# EAGLE design Adafruit TFT144 Breakout rev B (EAGLE 6.4)
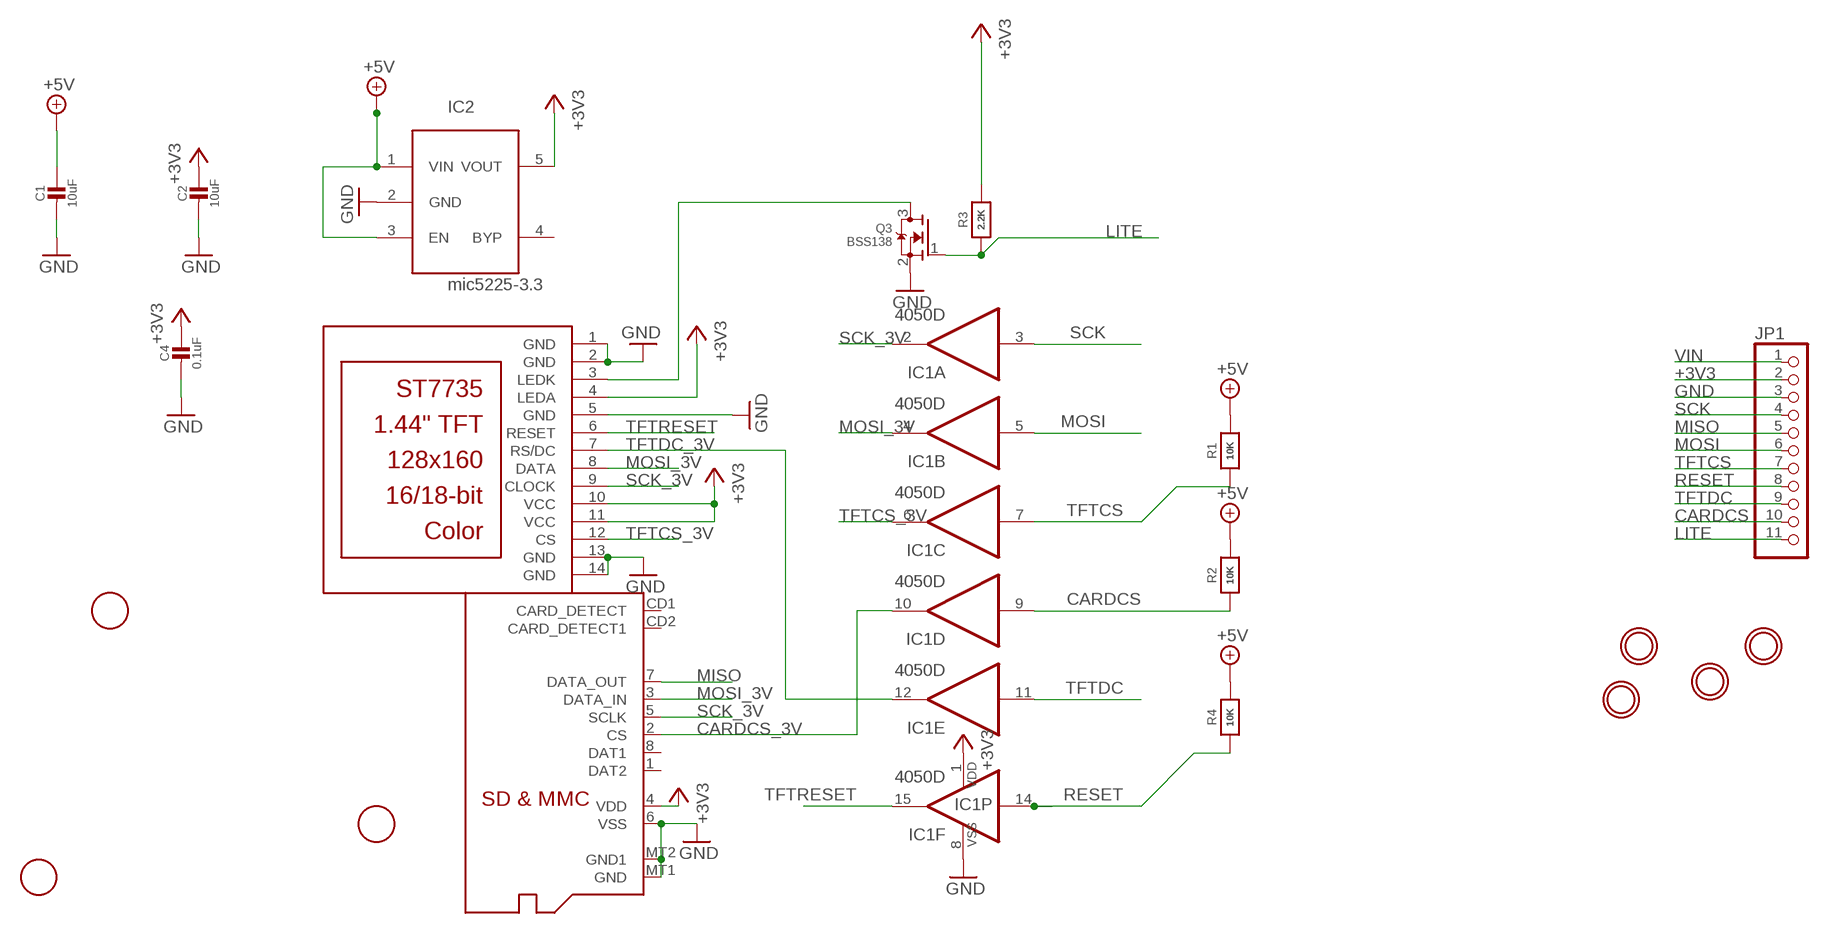
[diagram p0: schematic, sheet 1]

## Parts
C1  10uF  CAP_CERAMIC0805-NOOUTLINE  [0805-NO]
C2  10uF  CAP_CERAMIC0805-NOOUTLINE  [0805-NO]
C4  0.1uF  CAP_CERAMIC0805-NOOUTLINE  [0805-NO]
IC1  4050D  [SO16]
IC2  mic5225-3.3  LP298XS  [SOT23-5L]
JP1  HEADER-1X1176MIL  [1X11_ROUND_76]
Q2  MICROSD  [MICROSD]
Q3  BSS138  MOSFET-NWIDE  [SOT23-WIDE]
R1  10K  RESISTOR0805_NOOUTLINE  [0805-NO]
R2  10K  RESISTOR0805_NOOUTLINE  [0805-NO]
R3  2.2K  RESISTOR0805_NOOUTLINE  [0805-NO]
R4  10K  RESISTOR0805_NOOUTLINE  [0805-NO]
TFT2  DISP_LCD_ST7735_1.44IN  [TFT_1.44IN_128_128]
U$3  FIDUCIAL  [FIDUCIAL_1MM]
U$4  FIDUCIAL  [FIDUCIAL_1MM]
U$5  FIDUCIAL  [FIDUCIAL_1MM]
U$7  MOUNTINGHOLE2.5  [MOUNTINGHOLE_2.5_PLATED]
U$8  MOUNTINGHOLE2.5  [MOUNTINGHOLE_2.5_PLATED]
U$9  MOUNTINGHOLE2.5  [MOUNTINGHOLE_2.5_PLATED]
U$10  MOUNTINGHOLE2.5  [MOUNTINGHOLE_2.5_PLATED]

## Nets
+3V3 [power]: C2.1 C4.1 IC1.1(P:VDD) IC2.5(VOUT) JP1.2 Q2.4(VDD) R3.2 TFT2.4(LEDA) TFT2.10(VCC) TFT2.11(VCC)
CARDCS: IC1.9(D:I) JP1.10 R2.1
CARDCS_3V: IC1.10(D:O) Q2.2(CS)
GND: C1.2 C2.2 C4.2 IC1.8(P:VSS) IC2.2(GND) JP1.3 Q2.6(VSS) Q2.MT1(GND) Q2.MT2(GND1) Q3.2(S) TFT2.1(GND) TFT2.2(GND) TFT2.5(GND) TFT2.13(GND) TFT2.14(GND)
LITE: JP1.11 Q3.1(G) R3.1
MISO: JP1.5 Q2.7(DATA_OUT)
MOSI: IC1.5(B:I) JP1.6
MOSI_3V: IC1.4(B:O) Q2.3(DATA_IN) TFT2.8(DATA)
N$5: Q3.3(D) TFT2.3(LEDK)
RESET: IC1.14(F:I) JP1.8 R4.1
SCK: IC1.3(A:I) JP1.4
SCK_3V: IC1.2(A:O) Q2.5(SCLK) TFT2.9(CLOCK)
TFTCS: IC1.7(C:I) JP1.7 R1.1
TFTCS_3V: IC1.6(C:O) TFT2.12(CS)
TFTDC: IC1.11(E:I) JP1.9
TFTDC_3V: IC1.12(E:O) TFT2.7(RS/DC)
TFTRESET: IC1.15(F:O) TFT2.6(RESET)
VIN [power]: C1.1 IC2.1(VIN) IC2.3(EN) JP1.1 R1.2 R2.2 R4.2 ; supply symbol labelled +5V
Unconnected: IC2.4(BYP) Q2.1(DAT2) Q2.8(DAT1) Q2.CD1(CARD_DETECT) Q2.CD2(CARD_DETECT1)

## Library data of the parts
C1 C2 C4 = microbuilder:CAP_CERAMIC: Ceramic Capacitors For new designs, use the packages preceded by an '_' character since they are more reliable: The following footprints should be used on most boards: _0402 - Standard footprint for regular board layouts _0603 - Standard footprint for regular board layouts _0805 - Standard footprint for regular board layouts _1206 - Standard footprint for regular board layouts For extremely tight-pitch boards where space is at a premium, the following 'micro-pitch' footprints can be used (smaller pads, no silkscreen outline, etc.): _0402MP - Micro-pitch footprint for very dense/compact boards _0603MP - Micro-pitch footprint for very dense/compact boards _0805MP - Micro-pitch footprint for very dense/compact boards _1206MP - Micro-pitch footprint for very dense/compact boards
IC1 = 40xx:4050: Hex non-inverting BUFFER
IC2 = adafruit:LP298X
JP1 = microbuilder:HEADER-1X11
Q2 = adafruit:MICROSD: Micro-SD / Transflash card holder with SPI pinout For the 3M # 2908-05WB-MG and/or 4UCON #19656 push-push type
Q3 = microbuilder:MOSFET-N: N-Channel Mosfet LEGEND VDS: Voltage Drain-Source ID: Drain Current RDS(ON): Drain-Source On-State Resistance VGS(TH): Gate-Source Threshold Voltage CISS: Drain-Source Input Capacitance SOT-23 Name VDS ID RDS(ON) VGS(TH) CISS Order Number 2N7002E 60V 260mA 2.5 Ohm 2.5V @ 250uA 26.7pF @ 25V 2N7002ET1GOSTR-ND BSH103 30V 850mA 400 mOhm 400mV @ 1mA 83pF @ 24V BSH103,235-ND BSS138 60V 320mA 1.6 Ohm 1.5V @ 250uA 50pF @ 10V Mouser: 771-BSS138PW115 DMN2075U-7 20V 4.2A 38 mOhm 1V @ 250 uA 594.3pF @ 10V DMN2075U-7DICT-ND * BSS138 good choice for I2C level-shifting POWERPAK 1212-8 Name VDS ID RDS(ON) VGS(TH) CISS Order Number Si7308DN 60V 6A 58 mOhm 3V @ 250uA 665pF @ 15V SI7308DN-T1-E3CT-ND
R1-R4 = microbuilder:RESISTOR: Resistors For new designs, use the packages preceded by an '_' character since they are more reliable: The following footprints should be used on most boards: _0402 - Standard footprint for regular board layouts _0603 - Standard footprint for regular board layouts _0805 - Standard footprint for regular board layouts _1206 - Standard footprint for regular board layouts For extremely tight-pitch boards where space is at a premium, the following 'micro-pitch' footprints can be used (smaller pads, no silkscreen outline, etc.): _0402MP - Micro-pitch footprint for very dense/compact boards _0603MP - Micro-pitch footprint for very dense/compact boards _0805MP - Micro-pitch footprint for very dense/compact boards _1206MP - Micro-pitch footprint for very dense/compact boards
TFT2 = microbuilder:DISP_LCD_ST7735_1.44IN
U$3-U$5 = adafruit:FIDUCIAL: For use by pick and place machines to calibrate the vision/machine, 1mm By microbuilder.eu
U$7-U$10 = microbuilder:MOUNTINGHOLE: Mounting Hole For #2 screws (0.086"/2.18mm width, 0.094"/2.4mm hole) use 2.5mm; BOM: EXCLUDE

## Net classes
1 power: width 0.406 mm

## Board
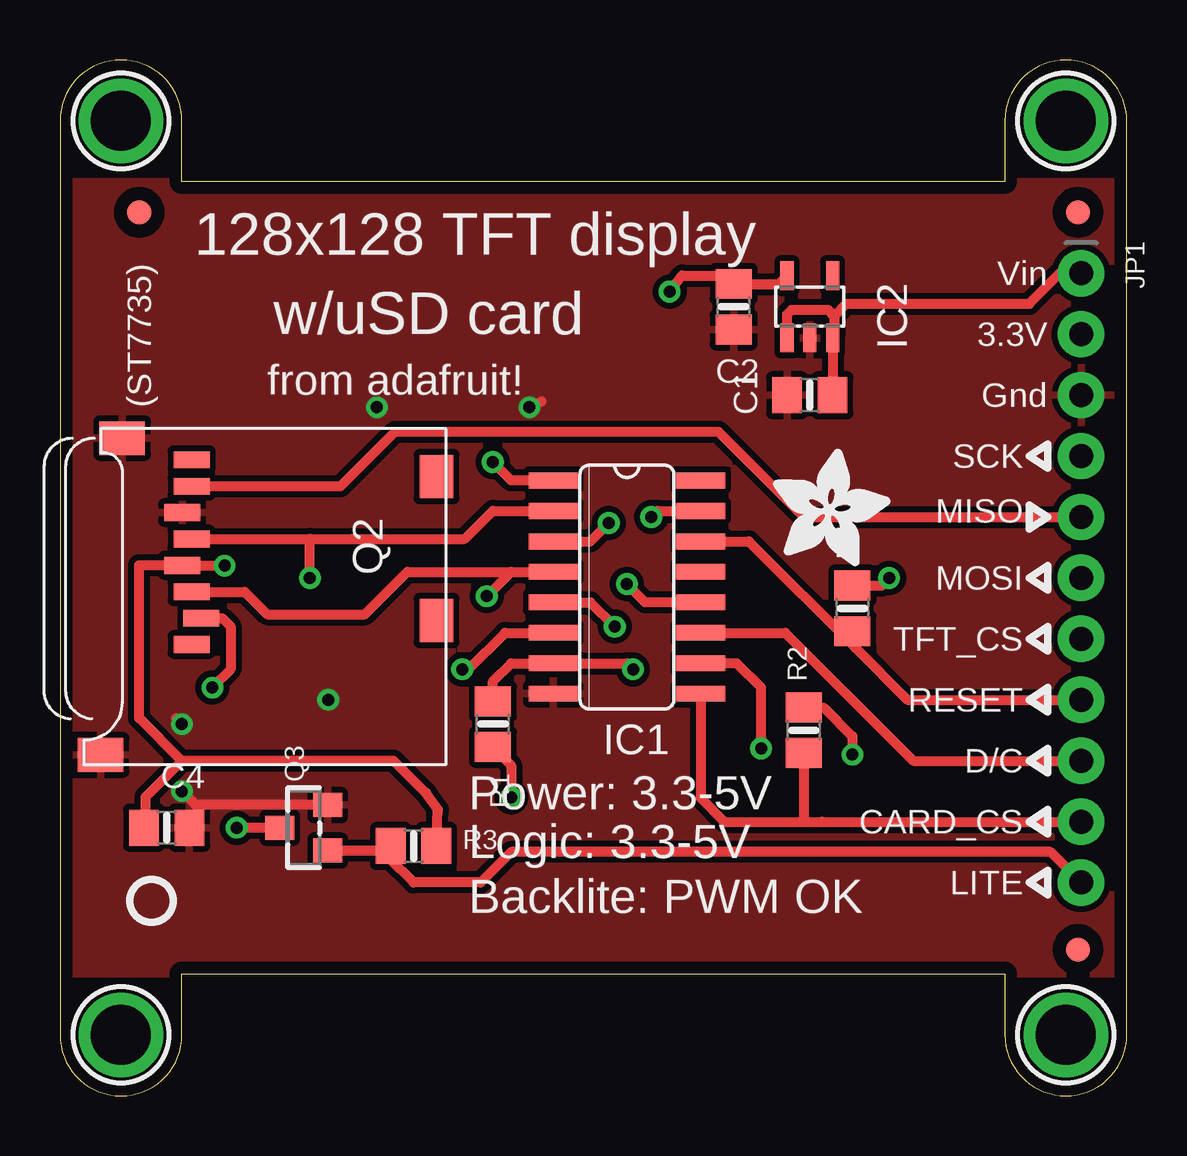
[diagram p1: board, top side]
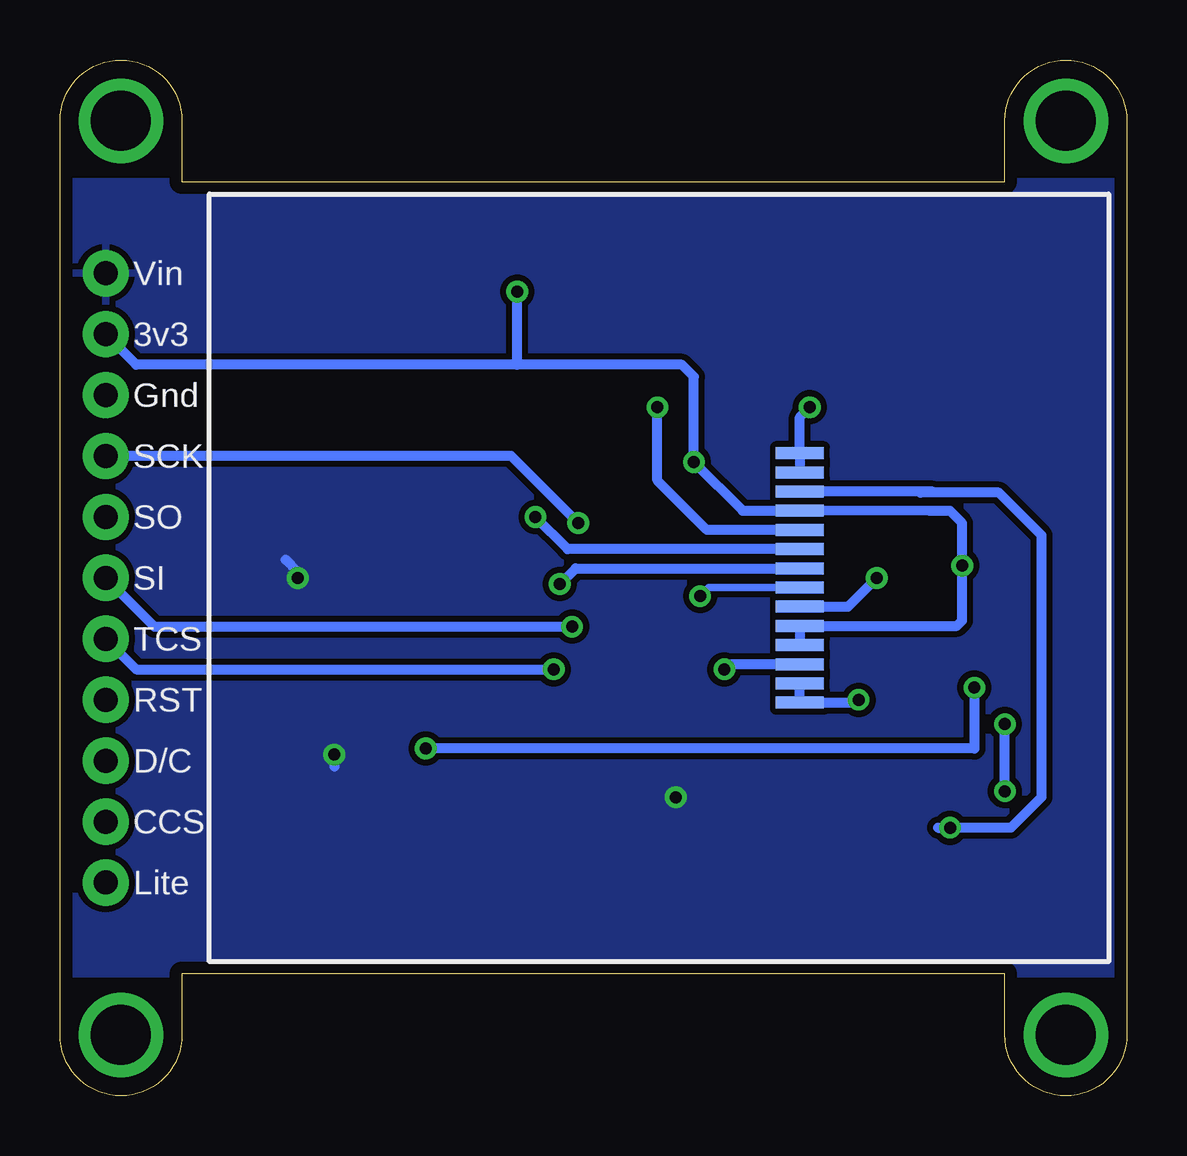
[diagram p2: board, bottom side, seen from below]

Size 44.45 x 43.18 mm. Coordinates in mm from the lower left corner, seen from the top.
Outline: 39.37,5.08 39.37,2.54 arc90 41.91,0 arc90 44.45,2.54 44.45,40.64 arc90 41.91,43.18 arc90 39.37,40.64 39.37,38.1 5.08,38.1 5.08,40.64 arc90 2.54,43.18 arc90 0,40.64 0,2.54 arc90 2.54,0 arc90 5.08,2.54 5.08,5.08 39.37,5.08
Copper layers (1*16): Top 0.035mm / dielectric 1.5mm / Bottom 0.035mm
Design rules "default *": minimum track width 10mil, minimum drill 14mil, track to track 10mil, track to pad 10mil, pad to pad 10mil, via to via 10mil, smd to smd 8mil, copper to edge 20mil, drill to drill 8mil, minimum pad ring 10mil, minimum via ring 8mil, stop-mask expansion 4mil, vias tented up to drill 20mil, thermal gap 10mil

### Footprints (pad centres in the part's own frame; a part is rotated, then mirrored left to right if it is on the bottom)
0805-NO = smd 1.24 x 1.5: 1 -0.95,0; 2 0.95,0
SO16 = smd 0.66 x 2.032: 1 -4.445,-3.073; 2 -3.175,-3.073; 3 -1.905,-3.073; 4 -0.635,-3.073; 5 0.635,-3.073; 6 1.905,-3.073; 7 3.175,-3.073; 8 4.445,-3.073; 9 4.445,3.073; 10 3.175,3.073; 11 1.905,3.073; 12 0.635,3.073; 13 -0.635,3.073; 14 -1.905,3.073; 15 -3.175,3.073; 16 -4.445,3.073
SOT23-5L = smd 0.55 x 1.2: 1 -0.95,-1.3; 2 0,-1.3; 3 0.95,-1.3; 4 0.95,1.3; 5 -0.95,1.3
1X11_ROUND_76 = drill 1 pad 1.93: 1 -12.7,0; 2 -10.16,0; 3 -7.62,0; 4 -5.08,0; 5 -2.54,0; 6 0,0; 7 2.54,0; 8 5.08,0; 9 7.62,0; 10 10.16,0; 11 12.7,0
MICROSD = smd 0.7 x 1.5: 1 9,-10.64; 2 7.9,-10.24; 3 6.8,-10.64; 4 5.7,-11.04; 5 4.6,-10.64; 6 3.5,-11.04; 7 2.4,-10.64; 8 1.3,-10.64 | smd 1.8 x 1.4: CD1 2,-0.44; CD2 8,-0.44 | smd 1.4 x 1.9: MT1 0.4,-13.54; MT2 13.6,-14.44
SOT23-WIDE = smd 1 x 1.2: 1 -0.95,-1; 2 0.95,-1; 3 0,1
TFT_1.44IN_128_128 = smd 0.5 x 2: 1 5.2,12.855; 2 4.4,12.855; 3 3.6,12.855; 4 2.8,12.855; 5 2,12.855; 6 1.2,12.855; 7 0.4,12.855; 8 -0.4,12.855; 9 -1.2,12.855; 10 -2,12.855; 11 -2.8,12.855; 12 -3.6,12.855; 13 -4.4,12.855; 14 -5.2,12.855
FIDUCIAL_1MM = smd 1 x 1: 1 0,0
MOUNTINGHOLE_2.5_PLATED = drill 2.5 pad 3.2: P$1 0,0

### Placement (x,y rotation side)
C1  31.24,29.21 180 top
C2  28.07,32.89 270 top
C4  4.45,11.18 0 top
IC1  23.62,21.21 270 top
IC2  31.24,32.89 0 top
JP1  42.55,21.59 270 top
Q2  16.13,27.81 270 top
Q3  10.16,11.18 90 top
R1  18.03,15.49 270 top
R2  30.99,15.24 90 top
R3  14.73,10.41 0 top
R4  33.02,20.32 90 top
TFT2  0.76,21.59 90 bottom
U$1  [ADAFRUIT_5MM]  29.72,22.1 0 top
U$2  [PCBFEAT-REV-040]  3.81,8.13 0 top
U$3  42.42,6.1 0 top
U$4  3.3,36.83 0 top
U$5  42.42,36.83 0 top
U$7  2.54,40.64 0 top
U$8  2.54,2.54 0 top
U$9  41.91,40.64 0 top
U$10  41.91,2.54 0 top

### Tracks (layer width: path | path; a pad name or v marks a point on that pad's centre or on a via)
+3V3  (via drill 0.5)
  Top 0.406: IC2.5 29.94,33.84 C2.1 27.72,34.19 25.91,34.19 v25.4,33.53 | v6.86,22.1 6.87,22.11 Q2.4 3.3,22.11 3.3,15.75 5.08,13.97 | IC1.1 18.8,25.65 v18.03,26.42 | R3.2 15.75,11.94 15.24,12.63 13.9,13.97 5.08,13.97 | 5.08,13.97 3.56,12.45 3.56,11.24 C4.1
  Bottom 0.406: TFT2.11 TFT2.10 7.08,19.59 6.86,19.81 v6.86,22.1 6.86,23.88 7.37,24.38 8.23,24.38 TFT2.4 16.01,24.39 v18.03,26.42 18.03,29.97 18.54,30.48 25.4,30.48 | 25.4,30.48 v25.4,33.53 | 25.4,30.48 41.27,30.48 JP1.2
CARDCS
  Top 0.406: IC1.9 26.7,12.42 27.69,11.43 30.99,11.43 | JP1.10 31.75,11.43 30.99,11.43 | R2.1 30.99,11.43
CARDCS_3V  (via drill 0.5)
  Top 0.406: Q2.2 6.76,19.91 7.11,19.56 7.11,17.78 v6.35,17.02 | v29.21,14.48 29.21,17.02 28.19,18.03 IC1.10
  Bottom 0.406: v6.35,17.02 6.35,14.48 v29.21,14.48
GND  (via drill 0.5)
  Top 0.406: v13.21,28.7 12.95,28.7 | Q3.2 5.65,12.13 v5.08,12.7 | v5.08,15.49 4.83,15.75 | v19.56,28.7 20.07,28.96
  Bottom 0.406: TFT2.2 TFT2.1 13.62,28.29 v13.21,28.7 | TFT2.13 TFT2.14 11.3,16.39 v11.18,16.51 | v5.08,12.7 v5.08,15.49 | TFT2.5 17.49,23.59 19.56,25.65 v19.56,28.7
  pour Top: 0,5.08 0,38.1 44.45,38.1 44.45,5.08
LITE
  Top 0.406: JP1.11 41.27,10.16 18.8,10.16 17.53,8.89 14.73,8.89 13.72,9.91 13.72,10.35 R3.1 13.59,10.23 Q3.1
MISO
  Top 0.406: Q2.7 11.7,25.41 13.97,27.69 27.43,27.69 30.99,24.13 JP1.5
MOSI  (via drill 0.5)
  Top 0.406: IC1.5 22.1,20.57 v23.11,19.56
  Bottom 0.406: JP1.6 40.51,19.56 v23.11,19.56
MOSI_3V  (via drill 0.5)
  Top 0.406: 18.8,21.84 17.96,21.01 17.78,20.94 v17.78,20.83 | 18.8,21.84 IC1.4 | Q2.3 7.69,21.01 8.64,20.07 12.7,20.07 14.48,21.84 18.8,21.84
  Bottom 0.305: 12.85,21.19 17.42,21.19 v17.78,20.83
  Bottom 0.406: TFT2.8 12.85,21.19
N$5  (via drill 0.5)
  Top 0.406: Q3.3 v7.37,11.18
  Bottom 0.406: 8.08,25.19 TFT2.3 8.64,25.19 8.59,25.15 5.33,25.15 3.56,23.37 3.56,12.45 4.83,11.18 v7.37,11.18 7.87,11.18
RESET
  Top 0.406: IC1.14 28.7,23.11 33.15,18.67 | 33.15,18.67 35.31,16.51 JP1.8 | R4.1 33.15,19.37 33.15,18.67
SCK  (via drill 0.5)
  Top 0.406: IC1.3 22.1,23.11 v22.86,23.88
  Bottom 0.406: v22.86,23.88 24.38,25.4 25.65,26.67 JP1.4
SCK_3V  (via drill 0.5)
  Top 0.406: Q2.5 10.41,23.21 | IC1.2 18.03,24.38 16.86,23.21 12.19,23.21 10.41,23.21 | v10.41,21.59 10.41,23.21
  Bottom 0.406: TFT2.9 11.61,20.39 v10.41,21.59
TFTCS  (via drill 0.5)
  Top 0.406: v23.88,17.78 23.62,18.03 IC1.7 18.8,18.03 18.03,17.27 R1.1
  Bottom 0.406: JP1.7 41.27,17.78 v23.88,17.78
TFTCS_3V  (via drill 0.5)
  Top 0.406: v16.76,17.78 17.02,17.78 18.54,19.3 IC1.6
  Bottom 0.406: TFT2.12 16.55,17.99 v16.76,17.78
TFTDC
  Top 0.406: IC1.11 30.23,19.3 35.56,13.97 JP1.9
TFTDC_3V  (via drill 0.5)
  Top 0.406: IC1.12 24.38,20.57 v23.62,21.34
  Bottom 0.406: v23.62,21.34 22.97,21.99 TFT2.7
TFTRESET  (via drill 0.5)
  Top 0.406: v24.64,24.13 24.89,24.38 IC1.15
  Bottom 0.406: TFT2.6 23.3,22.79 v24.64,24.13
VIN  (via drill 0.5)
  Top 0.406: C1.1 IC2.3 32.26,31.66 32.26,32.51 | IC2.1 30.29,32.58 30.48,32.77 32,32.77 32.26,32.51 | 32.26,32.51 32.77,33.02 40.39,33.02 41.66,34.29 JP1.1 | R4.2 34.22,21.27 v34.54,21.59 | R2.2 31.82,16.19 33.02,14.99 v33.02,14.22 | R1.2 18.8,13.78 v18.8,12.45
  Bottom 0.406: v34.54,21.59 34.54,21.84 35.05,22.35 | v33.02,14.22 33.02,13.72 | v18.8,12.45 18.8,12.19
  pour Bottom: 44.45,5.08 0,5.08 0,38.1 44.45,38.1

### Text on the board
tPlace: 128x128 TFT display | Vin | w/uSD card | 3.3V | Gnd | (ST7735) | from adafruit! | SCK | MISO | MOSI | TFT_CS | RESET | D/C | Power: 3.3-5V | CARD_CS | Logic: 3.3-5V | LITE | Backlite: PWM OK
bPlace: Vin | 3v3 | Gnd | SCK | SO | SI | TCS | RST | D/C | CCS | Lite